# EAGLE design lm_board (EAGLE 7.5.0)

## Sheet 1 of 2
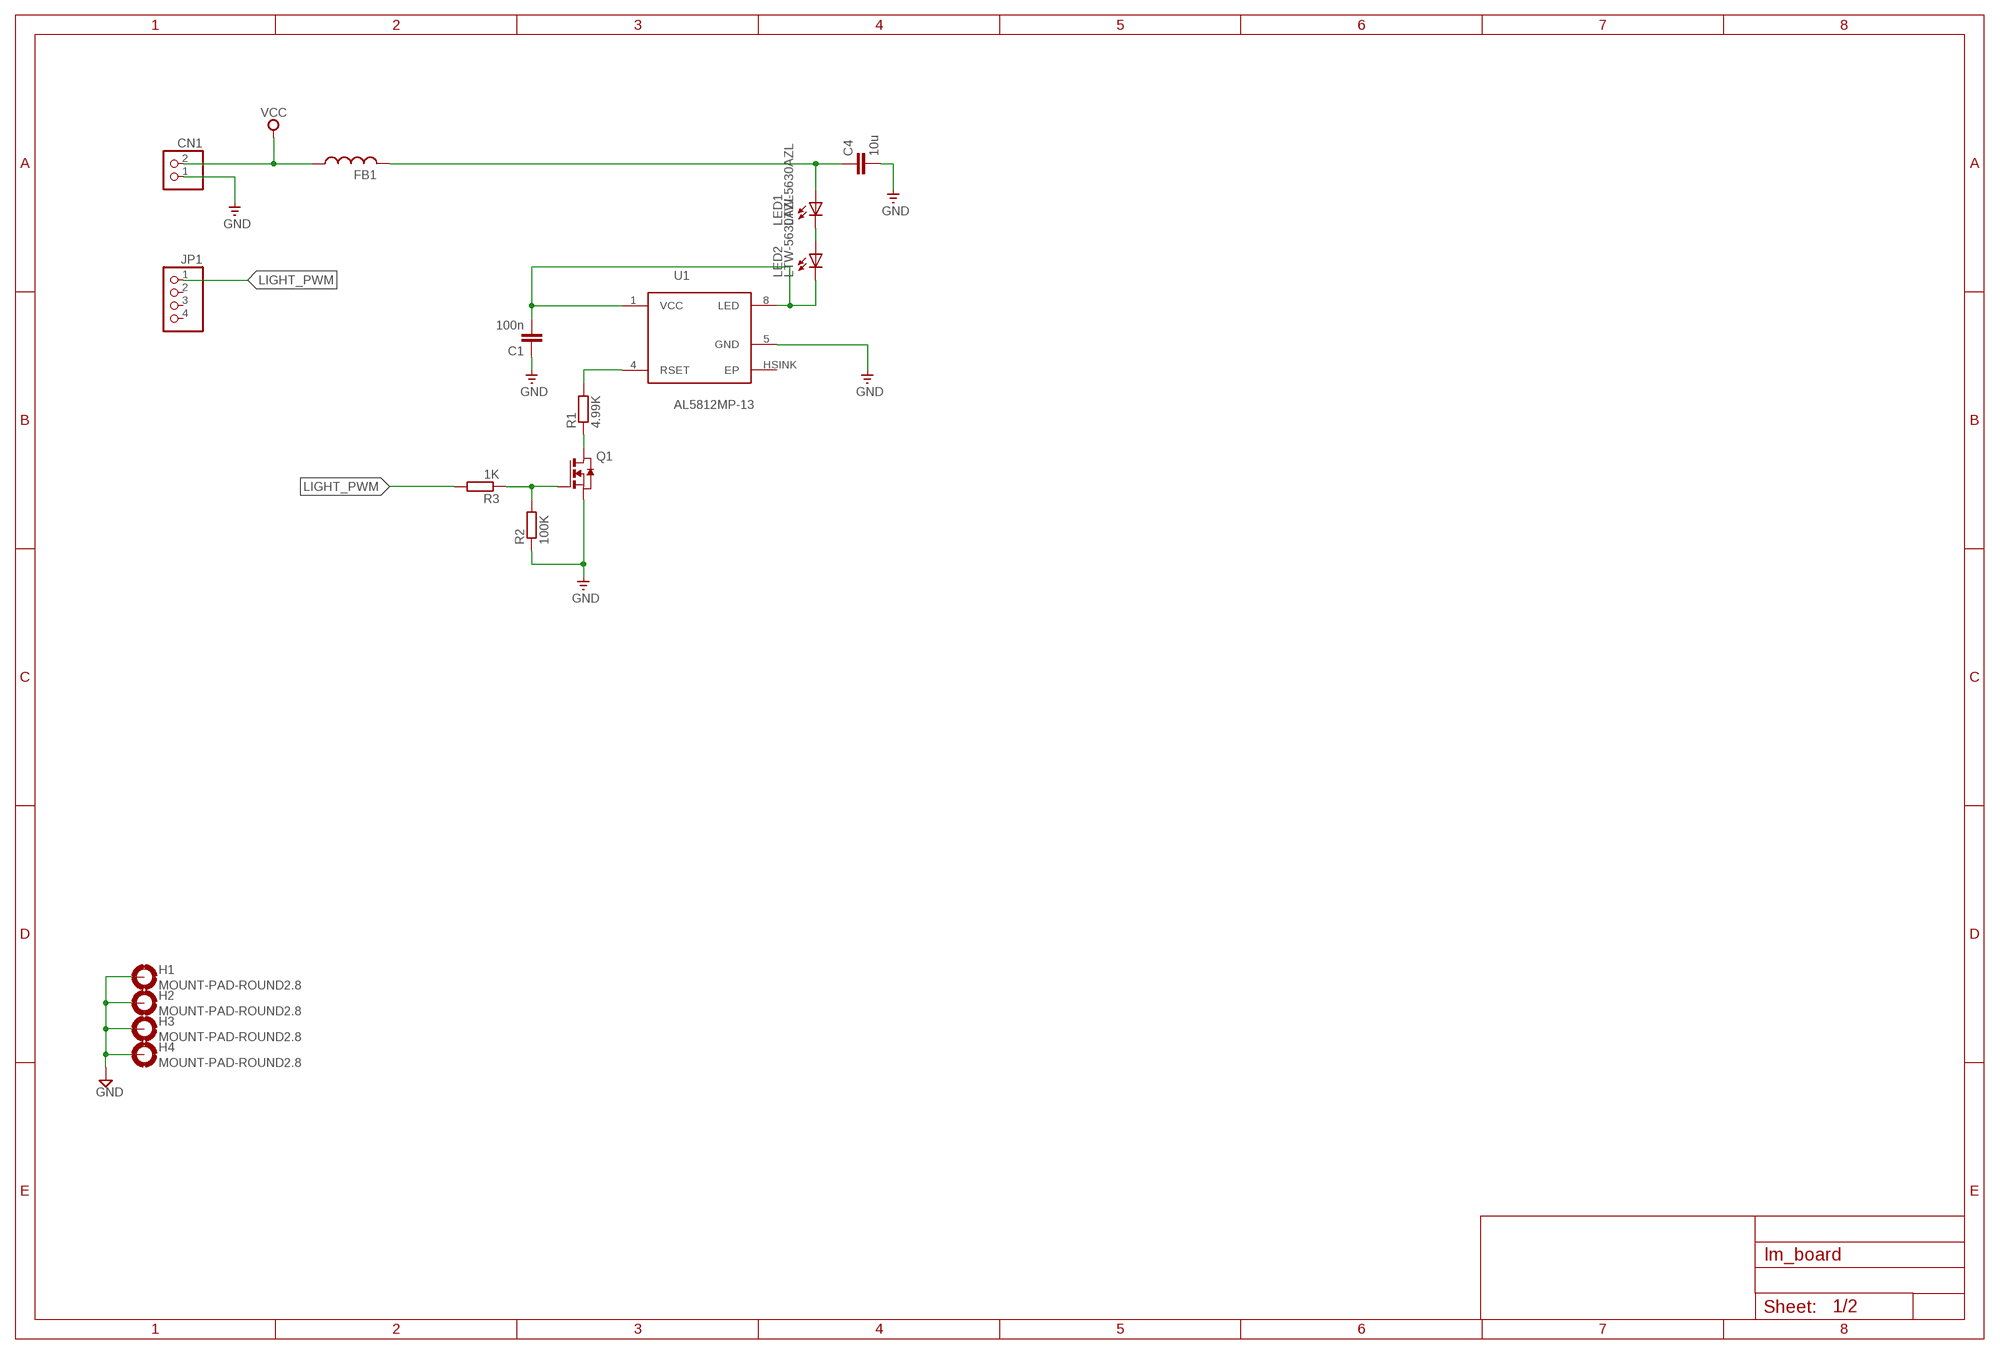
[diagram p0: schematic, sheet 1]

### Parts
C1  100n  C-EUC0402  [C0402]
C4  10u  C-EUC0402  [C0402]
CN1  JST_2PIN-THM  [JST-PH-2-THM]
FB1  FERRITESIZE_0805  [R0805]
H1  MOUNT-PAD-ROUND2.8  [2,8-PAD]
H2  MOUNT-PAD-ROUND2.8  [2,8-PAD]
H3  MOUNT-PAD-ROUND2.8  [2,8-PAD]
H4  MOUNT-PAD-ROUND2.8  [2,8-PAD]
JP1  PINHD-1X4  [1X04]
LED1  LTW-5630AZL  [LITEON-5630]
LED2  LTW-5630AZL  [LITEON-5630]
Q1  NMOS-FETSOT23  [SOT23]
R1  4.99K  R-EU_R0402  [R0402]
R2  100K  R-EU_R0402  [R0402]
R3  1K  R-EU_R0402  [R0402]
U1  AL5812MP-13  [MSOP-8EP]

### Nets
GND [GND]: C1.1 C4.2 CN1.1 H1.B2,8(MOUNT) H2.B2,8(MOUNT) H3.B2,8(MOUNT) H4.B2,8(MOUNT) Q1.2(S) R2.1 U1.5(GND) ; also sheet 2
LIGHT_PWM: JP1.1 R3.2
N$1: LED1.C1(C) LED1.C2(C) LED2.A1(A) LED2.A2(A) LED2.A3(A)
N$2: C1.2 LED2.C1(C) LED2.C2(C) U1.1(VCC) U1.8(LED)
N$4: C4.1 FB1.2 LED1.A1(A) LED1.A2(A) LED1.A3(A)
N$5: R1.2 U1.4(RSET)
N$6: Q1.3(D) R1.1
N$7: Q1.1(G) R2.2 R3.1
VCC: CN1.2 FB1.1 ; also sheet 2
Unconnected: JP1.2 JP1.3 JP1.4 U1.HSINK(EP)

### Notes on the sheet
- Hole

## Sheet 2 of 2
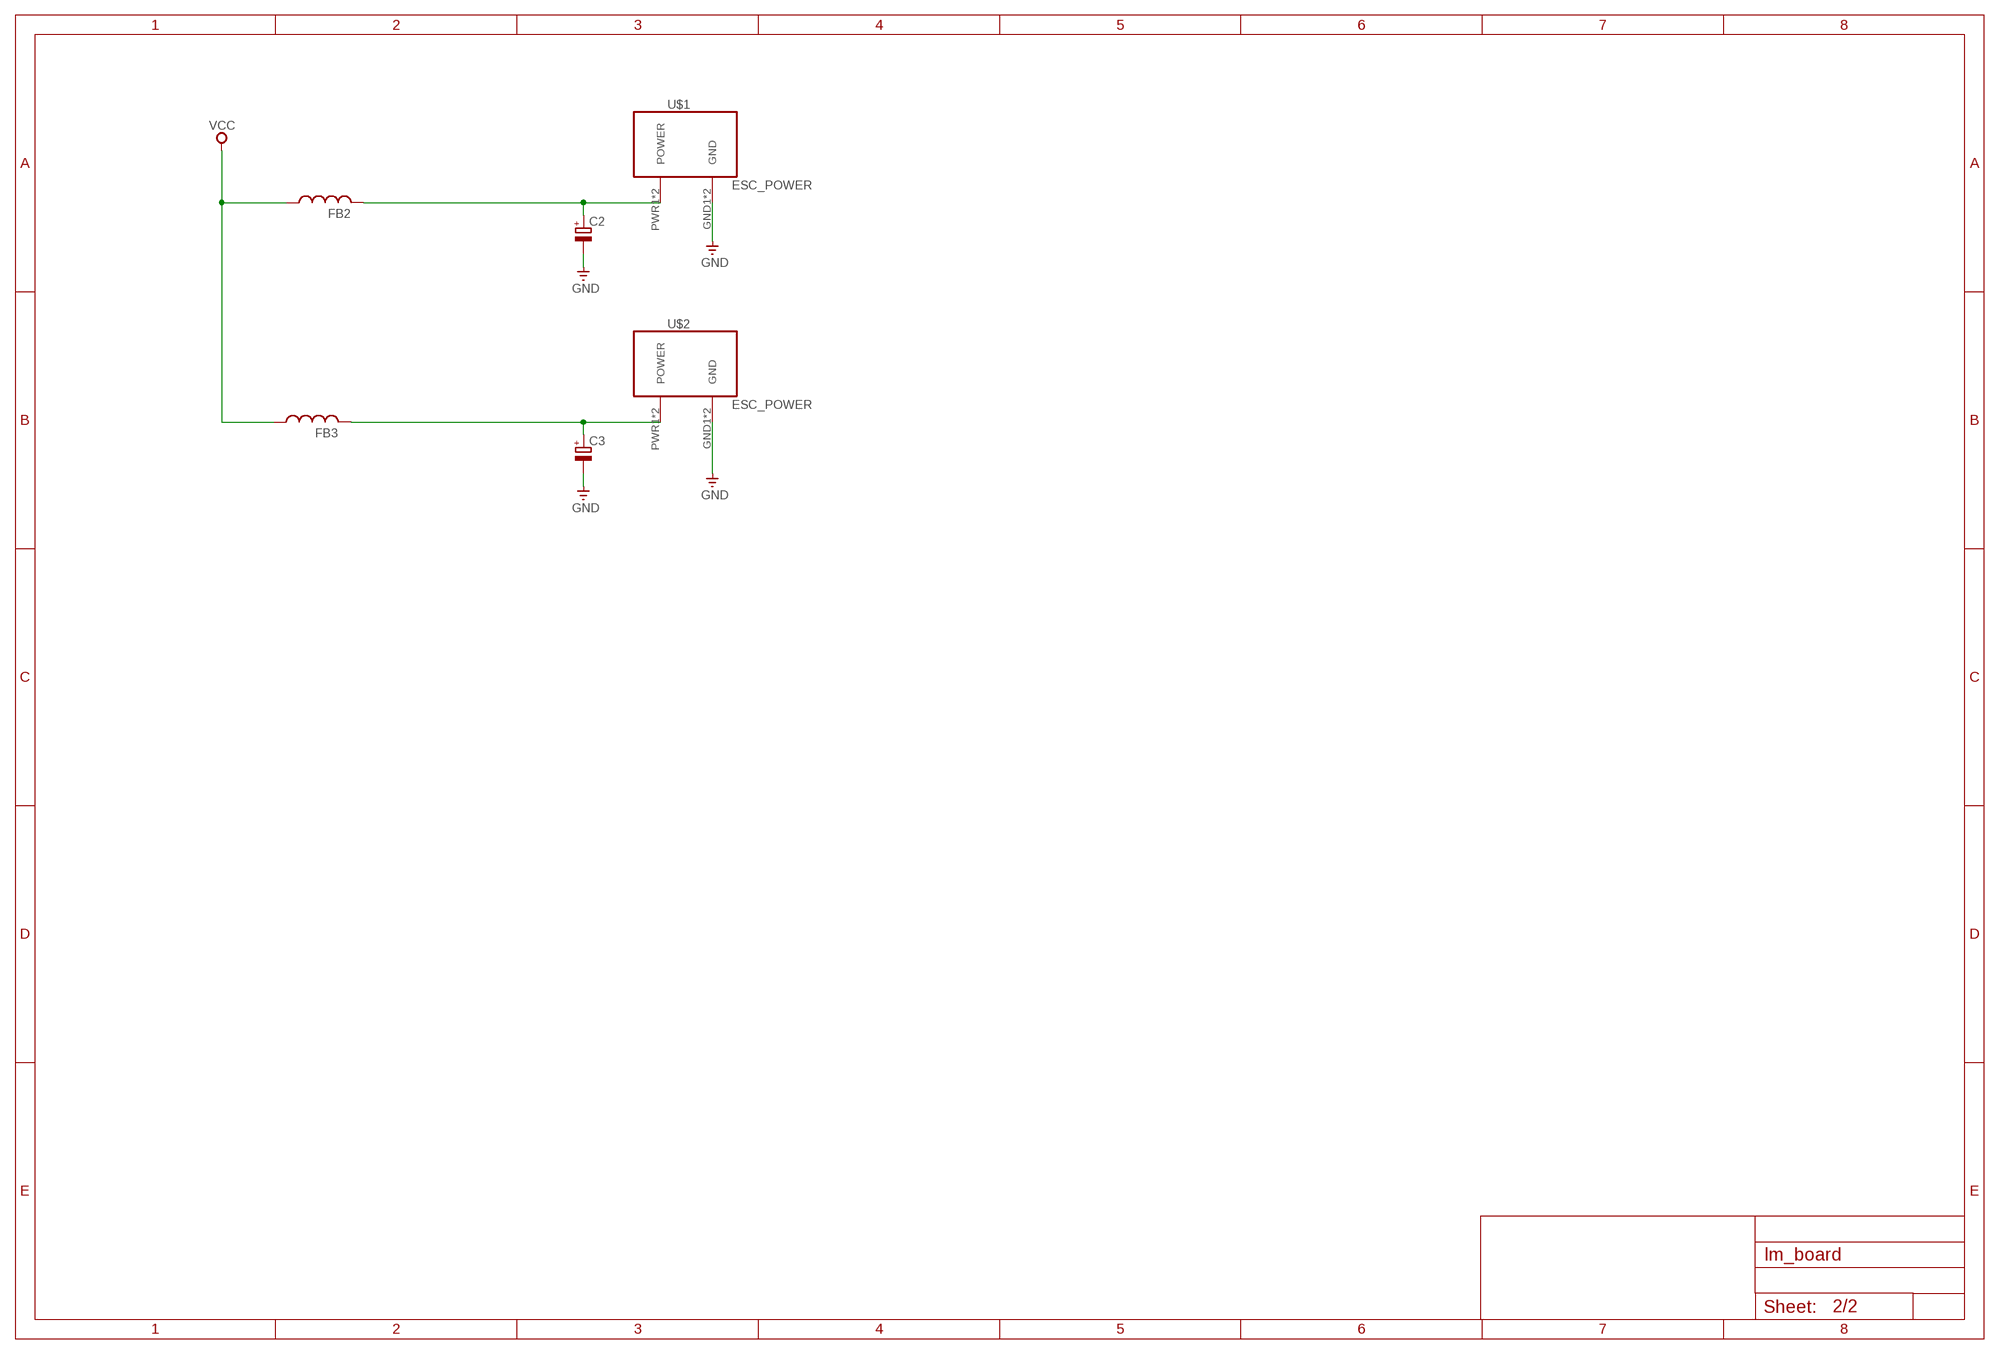
[diagram p1: schematic, sheet 2]

### Parts
C2  CPOL-EU153CLV-0810  [153CLV-0810]
C3  CPOL-EU153CLV-0810  [153CLV-0810]
FB2  FERRITESIZE_0805  [R0805]
FB3  FERRITESIZE_0805  [R0805]
U$1  ESC_POWER  [ESC_POWER]
U$2  ESC_POWER  [ESC_POWER]

### Nets
GND [GND]: C2.- C3.- U$1.GND1(GND) U$1.GND2(GND) U$2.GND1(GND) U$2.GND2(GND) ; also sheet 1
N$3: C3.+ FB3.2 U$2.PWR1(POWER) U$2.PWR2(POWER)
N$8: C2.+ FB2.2 U$1.PWR1(POWER) U$1.PWR2(POWER)
VCC: FB2.1 FB3.1 ; also sheet 1

## Library data of the parts
C1 C4 = resistor:C-EU: CAPACITOR, European symbol
C2 C3 = resistor:CPOL-EU: POLARIZED CAPACITOR, European symbol
CN1 = openblw:JST_2PIN: JST 2-Pin Connectors of various flavors SMT-RA (S2B-PH-SM4) 4UConnector #17311 SMT (B2B-PH-SM4) THM-RA (S2B-PH) THM (B2B-PH)
FB1-FB3 = openblw:FERRITE: Generic Surface Mount Ferrite Chip
H1-H4 = holes:MOUNT-PAD-ROUND: MOUNTING PAD, round
JP1 = pinhead:PINHD-1X4: PIN HEADER
LED1 LED2 = openblw:LTW-5630AZL: Lite-On 5x3 mm LTW-5630AZL White LED
Q1 = openblw:NMOS-FET: Generic NMOS FET
R1-R3 = resistor:R-EU_: RESISTOR, European symbol
U1 = openblw:AL5812: Diodes, Inc AL5812 LED Driver
U$1 U$2 = openblw:ESC_POWER

## Net classes
1 GND: width 0.508 mm, drill 0.3 mm, clearance 0.15 mm to class 0, clearance 0.15 mm

## Board
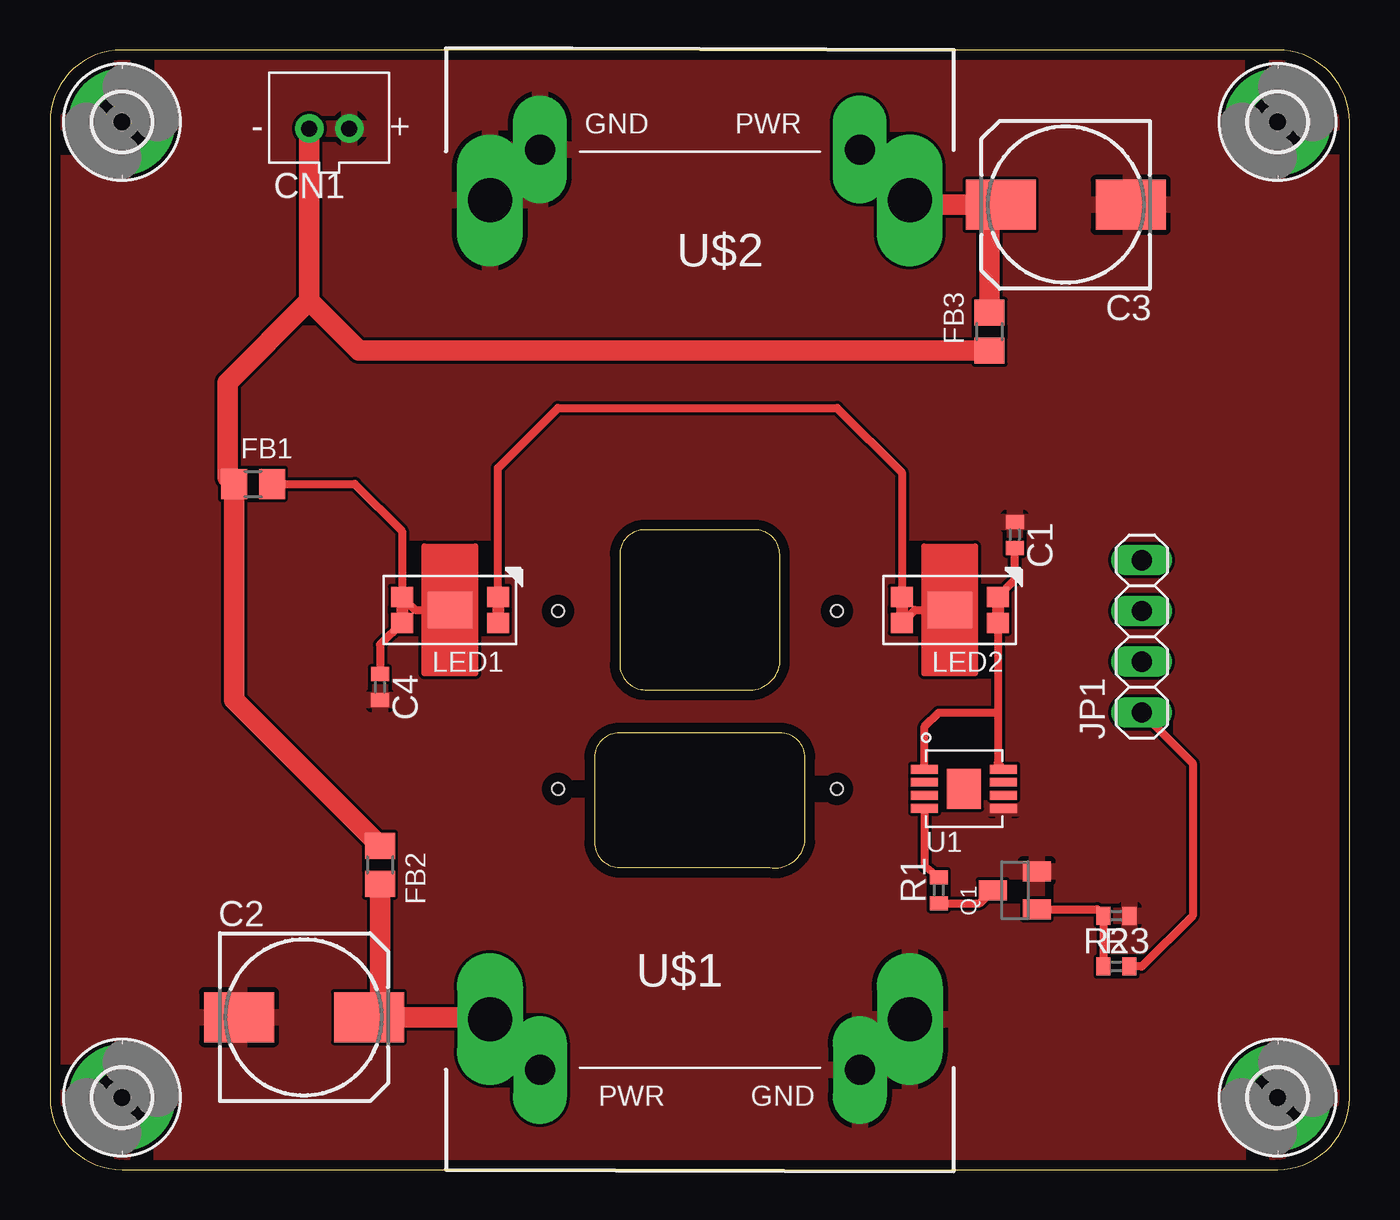
[diagram p2: board, top side]
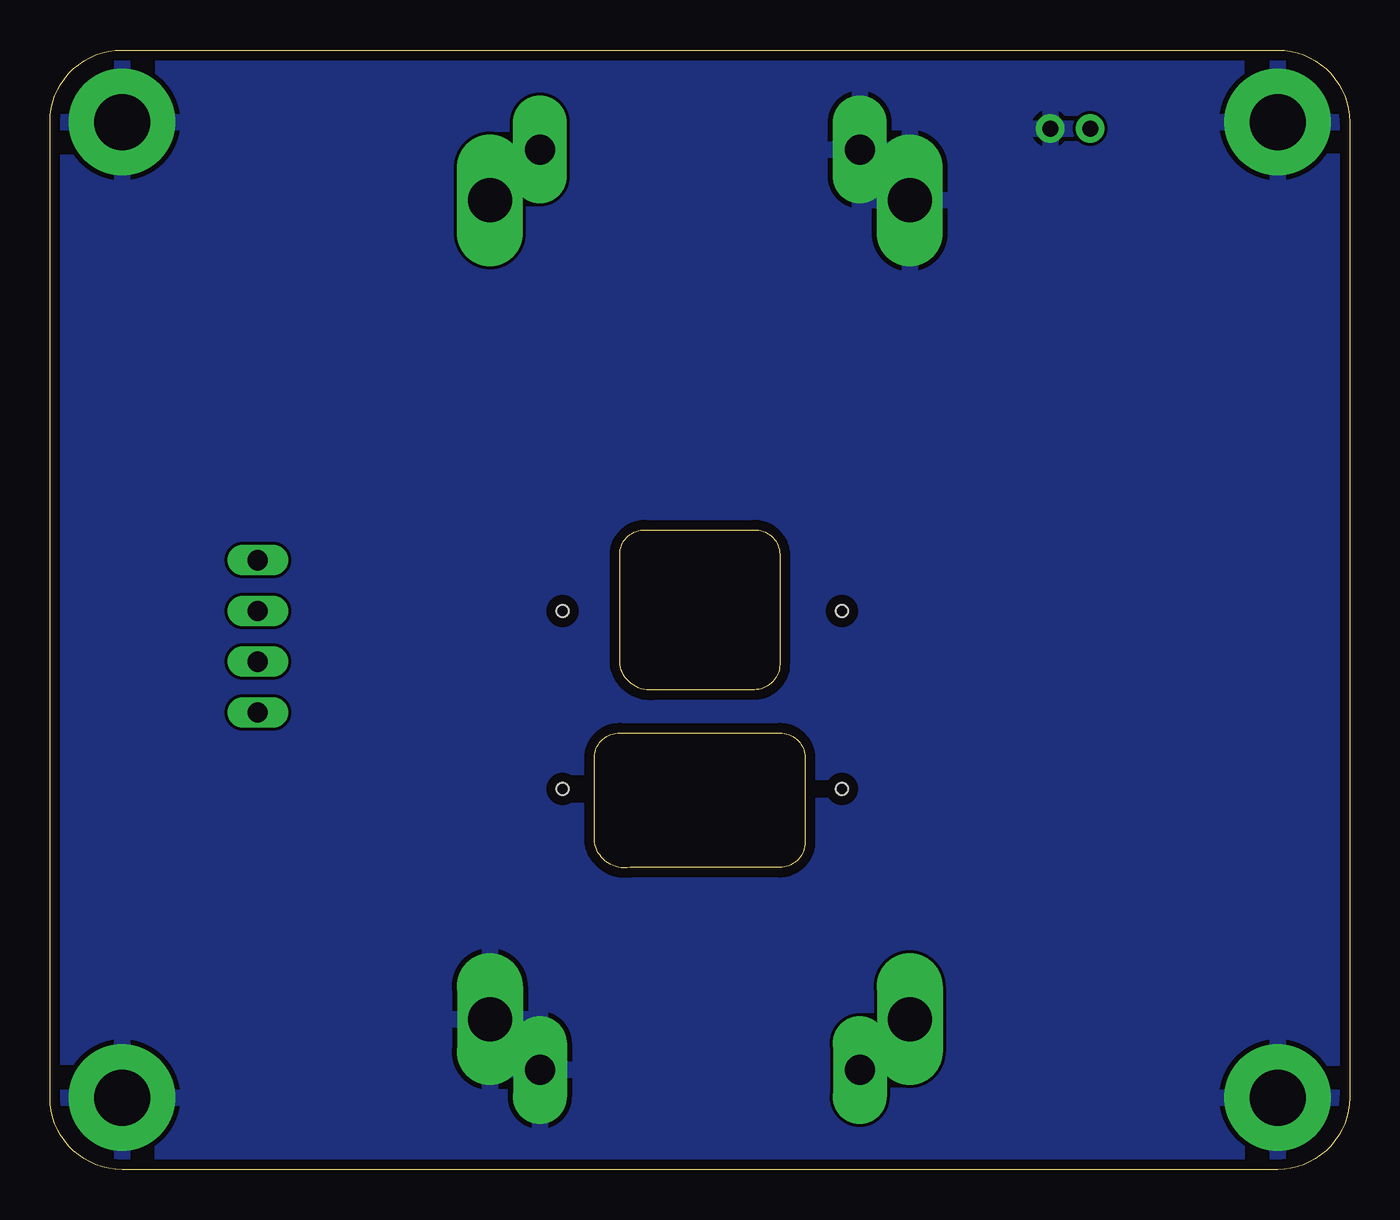
[diagram p3: board, bottom side, seen from below]

Size 65 x 56 mm. Coordinates in mm from the lower left corner, seen from the top.
Outline: 0,3.6 arc90 3.6,0 61.4,0 arc90 65,3.6 65,52.4 arc90 61.4,56 3.6,56 arc90 0,52.4 0,3.6
Outline: 29.77,32 arc90 28.5,30.77 28.5,25.27 arc90 29.77,24 34.73,24 arc90 36.5,25.27 36.5,30.77 arc90 35.23,32 29.77,32
Outline: 28.5,21.84 arc90 27.23,20.61 27.23,16.38 arc90 28.5,15.11 36,15.11 arc90 37.77,16.38 37.77,20.61 arc90 36.5,21.84 28.5,21.84
Copper layers (1+2*15+16): Top 0.018mm / dielectric 0.25mm / Route2 0.035mm / dielectric 1mm / Route15 0.035mm / dielectric 0.25mm / Bottom 0.018mm
Design rules "pban_5mil-l4": minimum track width 5mil, minimum drill 0.3mm, track to track 5mil, track to pad 0.229mm, pad to pad 5mil, via to via 5mil, smd to smd 5mil, copper to edge 0.5mm, drill to drill 0.5mm, minimum pad ring 0.15mm, minimum via ring 0.15mm, stop-mask expansion 4mil, vias tented up to drill 0.35mm, thermal gap 10mil
Holes 0.6 mm at 25.4,27.94 39.37,27.94 25.4,19.05 39.37,19.05

### Footprints (pad centres in the part's own frame; a part is rotated, then mirrored left to right if it is on the bottom)
C0402 = smd 0.7 x 0.9: 1 -0.65,0; 2 0.65,0
153CLV-0810 = smd 3.5 x 2.5: + 3.25,0; - -3.25,0
JST-PH-2-THM = drill 0.8 pad 1.422: 1 1,0; 2 -1,0
R0805 = smd 1.3 x 1.5: 1 -0.95,0; 2 0.95,0
2,8-PAD = drill 2.8 pad 5.334: B2,8 0,0
1X04 = drill 1.016 long: 1 -3.81,0; 2 -1.27,0; 3 1.27,0; 4 3.81,0
LITEON-5630 = smd 1.1 x 1: A1 2.4,-0.65; A2 2.4,0.65; C1 -2.4,-0.65; C2 -2.4,0.65 | smd 2.2 x 1.8: A3 0,0
SOT23 = smd 1 x 1.4: 1 -0.95,-1.1; 2 0.95,-1.1; 3 0,1.1
R0402 = smd 0.7 x 0.9: 1 -0.65,0; 2 0.65,0
MSOP-8EP = smd 0.45 x 1.35: 1 -0.975,-1.975; 2 -0.325,-1.975; 3 0.325,-1.975; 4 0.975,-1.975; 5 0.975,1.975; 6 0.325,1.975; 7 -0.325,1.975; 8 -0.975,1.975 | smd 2 x 1.7: HSINK 0,0
ESC_POWER = drill 2.2 pad 3.3 long: GND1 -10.5,-4.98; PWR1 10.5,-4.98 | drill 1.5 pad 2.7 long: GND2 -8,-2.44; PWR2 8,-2.44

### Placement (x,y rotation side)
C1  48.26,31.75 270 top
C2  12.7,7.62 0 top
C3  50.8,48.26 180 top
C4  16.51,24.13 270 top
CN1  13.97,52.07 0 top
FB1  10.16,34.29 0 top
FB2  16.51,15.24 270 top
FB3  46.99,41.91 90 top
H1  3.6,3.6 0 top
H2  61.4,3.6 0 top
H3  3.6,52.4 0 top
H4  61.4,52.4 0 top
JP1  54.61,26.67 90 top
LED1  20,28 180 top
LED2  45,28 180 top
Q1  48.26,13.97 90 top
R1  44.45,13.97 90 top
R2  53.34,12.7 180 top
R3  53.34,10.16 0 top
U1  45.72,19.05 270 top
U$1  32.5,2.54 180 top
U$2  32.5,53.46 0 top

### Tracks (layer width: path | path; a pad name or v marks a point on that pad's centre or on a via)
GND
  pour Top (rank 6): 0,55.88 0,0 65,0 65,56
  pour Bottom (rank 6): 0,55.88 0,0 65,0 65,56
LIGHT_PWM
  Top 0.406: JP1.1 57.15,20.32 57.15,12.7 54.61,10.16 R3.2
N$1
  Top 0.406: LED1.C1 22.4,35.1 25.4,38.1 39.37,38.1 42.6,34.87 LED2.A1 | LED2.A2 43.25,28 LED2.A3
  Top 0.61: LED1.C1 LED1.C2 | LED2.A1 LED2.A2
N$2
  Top 0.406: LED2.C2 47.4,22.86 | 47.4,22.86 47.4,20.32 U1.8 | U1.1 43.74,22.16 44.45,22.86 47.4,22.86 | LED2.C1 48.26,29.51 C1.2
  Top 0.61: LED2.C1 LED2.C2
N$3
  Top 1.016: C3.+ 46.99,48.26 | 46.99,48.26 43.62,48.26 U$2.PWR1 40.98,50.94 U$2.PWR2 | FB3.2 46.99,48.26
N$4
  Top 0.406: FB1.2 15.24,34.29 17.6,31.93 LED1.A1 18.25,28 LED1.A3 | LED1.A2 16.51,26.26 C4.1
  Top 0.61: LED1.A1 LED1.A2
N$5
  Top 0.406: U1.4 43.74,15.19 R1.2
N$6
  Top 0.406: R1.1 46.51,13.32 Q1.3
N$7
  Top 0.406: Q1.1 52.37,13.02 R2.2 R3.1
N$8
  Top 1.016: C2.+ 16.51,7.62 | 16.51,7.62 21.15,7.62 U$1.PWR1 23.79,4.94 U$1.PWR2 | FB2.2 16.51,7.62
VCC
  Top 1.016: CN1.2 12.97,43.45 | 12.97,43.45 8.89,39.37 8.89,34.61 FB1.1 9.21,23.49 FB2.1 | FB3.1 15.46,40.96 12.97,43.45